# Altium schematic sheet 1_P1.schdoc.schdoc
size 309 x 223 mm; Symbol: Sheet-Symbol_A4; Device: Sheet-Symbol_A4; Company: 嘉立创EDA; Version: V1.0; Page Size: A4; @Project Name: Soft_Pico_ESP; @Page Count: 1; @Update Date: 2024-06-13; @Create Date: 2024-06-13; @Schematic Name: Schematic2; @Page No: 1; @Page Name: P1
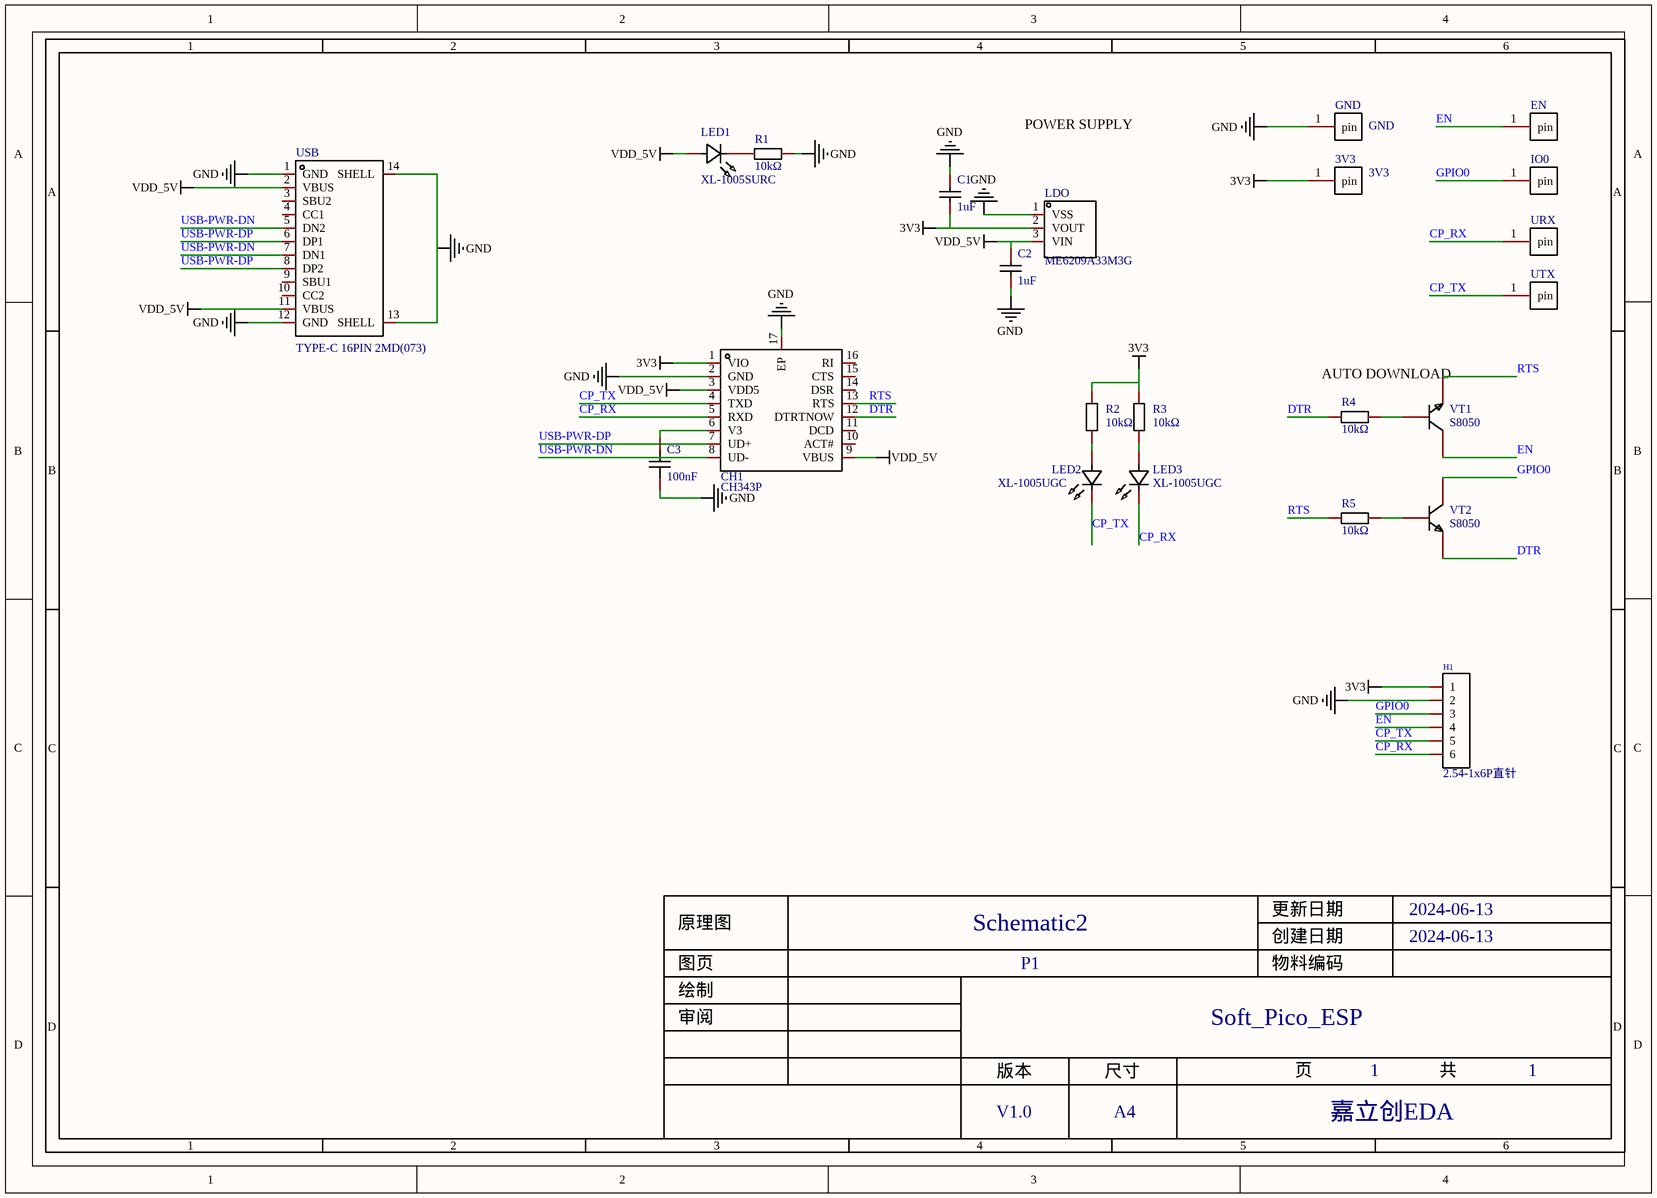
[diagram p0: 1_P1.schdoc.schdoc]

## Parts
3V3  3V3  [FPCB焊脚]
C1  1uF  [c0402]
C2  1uF  [c0402]
C3  100nF  [c0402]
CH1  CH343P  [TQFN-16_L3.0-W3.0-P0.50-BL-EP1.7]
EN  FPCB焊脚  [FPCB焊脚]  (value not drawn)
GND  GND  [FPCB焊脚]
H1  2.54-1x6P直针  [HDR-TH_6P-P2.54-V-M-1]
IO0  FPCB焊脚  [FPCB焊脚]  (value not drawn)
LDO  ME6209A33M3G  [SOT-23-3_L2.9-W1.6-P1.90-LS2.8-BR]
LED1  XL-1005SURC  [LED0402-R-RD_RED]
LED2  XL-1005UGC  [LED0402-RD_GREEN]
LED3  XL-1005UGC  [LED0402-RD_GREEN]
R1  value 10kΩ  [R0402]  (hidden comment: TR0402D10K0Q1025Z)
R2  value 10kΩ  [R0402]  (hidden comment: TR0402D10K0Q1025Z)
R3  value 10kΩ  [R0402]  (hidden comment: TR0402D10K0Q1025Z)
R4  value 10kΩ  [R0402]  (hidden comment: TR0402D10K0Q1025Z)
R5  value 10kΩ  [R0402]  (hidden comment: TR0402D10K0Q1025Z)
URX  FPCB焊脚  [FPCB焊脚]  (value not drawn)
USB  TYPE-C 16PIN 2MD(073)  [USB-C-SMD_TYPE-C-6PIN-2MD-073]
UTX  FPCB焊脚  [FPCB焊脚]  (value not drawn)
VT1  S8050  [SMT_TRIODE_NPN]
VT2  S8050  [SMT_TRIODE_NPN]

## Nets
3V3: 3V3.1(pin) C1.1 CH1.1(VIO) H1.1 LDO.2(VOUT) R2.1 R3.1
GND: C1.2 C2.1 C3.1 CH1.2(GND) CH1.17(EP) GND.1(pin) H1.2 LDO.1(VSS) R1.1 USB.1(GND) USB.12(GND) USB.13(SHELL) USB.14(SHELL)
VDD_5V: C2.2 CH1.3(VDD5) CH1.9(VBUS) LDO.3(VIN) LED1.1(K) USB.2(VBUS) USB.11(VBUS)
CP_RX: CH1.5(RXD) H1.6 LED3.1(K) URX.1(pin)
CP_TX: CH1.4(TXD) H1.5 LED2.1(K) UTX.1(pin)
DTR: CH1.12(DTRTNOW) R4.1 VT2.2(E)
EN: EN.1(pin) H1.4 VT1.3(C)
GPIO0: H1.3 IO0.1(pin) VT2.3(C)
RTS: CH1.13(RTS) R5.1 VT1.2(E)
USB-PWR-DN: CH1.8(UD-) USB.5(DN2) USB.7(DN1)
USB-PWR-DP: CH1.7(UD+) USB.6(DP1) USB.8(DP2)
NetC3_2: C3.2 CH1.6(V3)
NetLED1_2: LED1.2(A) R1.2
NetLED2_2: LED2.2(A) R2.2
NetLED3_2: LED3.2(A) R3.2
NetR4_2: R4.2 VT1.1(B)
NetR5_2: R5.2 VT2.1(B)

Not connected (* = marked no-connect by the designer): CH1 10(ACT#) 11(DCD) 14(DSR) 15(CTS) 16(RI); USB 3(SBU2) 4(CC1) 9(SBU1) 10(CC2)

## Notes on the sheet
- POWER SUPPLY
- AUTO DOWNLOAD
- 1
- 2
- 3
- 4
- 5
- 6
- A
- B
- C
- 原理图
- Schematic2
- 创建日期
- 更新日期
- 2024-06-13
- 审阅
- 绘制
- 图页
- P1
- 物料编码
- Soft_Pico_ESP
- D
- 版本
- 尺寸
- 页
- 共
- V1.0
- A4
- 嘉立创EDA

## Library data of the parts
3V3 EN GND IO0 URX UTX = FPCB焊脚: Add into BOM: yes; Symbol: FPCB焊脚; Device: FPCB焊脚; Convert to PCB: yes
  3V3: Name: 3V3
  GND: Name: GND
C1 C2 = CL05A105KP5NNNC: Manufacturer: SAMSUNG(三星); Add into BOM: yes; Tolerance: ±10%; Voltage Rated: 10V; Temperature Coefficient: X5R; Description: 容值:1uF;精度:±10%;额定电压:10V;材质(温度系数):X5R;; Name: 1uF; Symbol: CL05A105KP5NNNC; Device: CL05A105KP5NNNC; LCSC Part Name: 1uF ±10% 10V; Supplier Part: C14445; Manufacturer Part: CL05A105KP5NNNC; Supplier Footprint: 0402; JLCPCB Part Class: 扩展库; Datasheet: https://atta.szlcsc.com/upload/public/pdf/source/20160103/1457707670698.pdf; Supplier: LCSC; Convert to PCB: yes; Value: 1uF
C3 = CC0402KRX7R7BB104: Manufacturer: YAGEO(国巨); Add into BOM: yes; Tolerance: ±10%; Voltage Rated: 16V; Temperature Coefficient: X7R; Description: 容值:100nF;精度:±10%;额定电压:16V;材质(温度系数):X7R;; Name: 100nF; Symbol: CC0402KRX7R7BB104; Device: CC0402KRX7R7BB104; LCSC Part Name: 100nF ±10% 16V; Supplier Part: C60474; Manufacturer Part: CC0402KRX7R7BB104; Supplier Footprint: 0402; JLCPCB Part Class: 扩展库; Datasheet: https://atta.szlcsc.com/upload/public/pdf/source/20211223/9278FD768280B81DDBEF48FA36411A03.pdf; Supplier: LCSC; Convert to PCB: yes; Value: 100nF
CH1 = CH343P: Manufacturer: WCH(南京沁恒); Add into BOM: yes; Description: 应用功能:-;接口协议:-;; Name: CH343P; Symbol: CH343P; Device: CH343P; LCSC Part Name: CH343P; Supplier Part: C2846043; Manufacturer Part: CH343P; Supplier Footprint: TQFN-16-EP(3x3); JLCPCB Part Class: 扩展库; Datasheet: https://atta.szlcsc.com/upload/public/pdf/source/20211010/C2846043_7FA705E1F14A2906F6A2AFA45FA28209.pdf; Supplier: LCSC; Convert to PCB: yes; Applications Function: -; Protocol: -
H1 = 2.54-1x6P直针: Manufacturer: BOOMELE(博穆精密); Symbol: Header-Male-2.54_1x6; Add into BOM: yes; Pin Structure: 1x6P; Pitch: 2.54mm; Circluar Pins/Square Pins: 方针; Current Rating (Max): 3A; Description: 插针结构:1x6P;间距:2.54mm;行距:-;圆针/方针:方针;安装类型:直插;排数:单排;总PIN位数:6P;额定电流:3A;额定电压:-;配合针长度:-;塑高:-;触头材质:黄铜;触头镀层:-;工作温度范围:-40℃~+105℃;颜色:黑色;; Name: 2.54-1x6P直针; Device: 2.54-1x6P直针; Supplier: LCSC; Manufacturer Part: 2.54-1x6P直针; Supplier Part: C37208; JLCPCB Part Class: 扩展库; LCSC Part Name: 间距:2.54mm 1x6P 直插 方针; Supplier Footprint: 插件,P=2.54mm; Convert to PCB: yes; Row Spacing: -; Mounting Type: 直插; Number of Rows: 单排; Number of Pins: 6P; Voltage Rating (Max): -; Length of Mating Pin: -; Insulation Height: -; Contact Material: 黄铜; Contact Plating: -; Operating Temperature Range: -40℃~+105℃; Color: 黑色
LDO = ME6209A33M3G: Manufacturer: MICRONE(南京微盟); Add into BOM: yes; Output Type: 固定; Maximum Input Voltage: 18V; Output Voltage: 3.3V; MAX Output Current: 250mA; Dropout Voltage: 80mV@(40mA); Output Polarity: 正极; Number of Outputs: 1; Description: 输出类型:固定;最大输入电压:18V;输出电压:3.3V;最大输出电流:250mA;电源纹波抑制比(PSRR):-;输出极性:正极;; Name: ME6209A33M3G; Symbol: ME6209A33M3G; Device: ME6209A33M3G; Supplier: LCSC; Manufacturer Part: ME6209A33M3G; Supplier Part: C83508; JLCPCB Part Class: 扩展库; LCSC Part Name: 输入18V 输出3.3V 250mA; Supplier Footprint: SOT-23-3L; Datasheet: https://atta.szlcsc.com/upload/public/pdf/source/20161212/1481539101152.pdf; Convert to PCB: yes; Power Supply Rejection Ratio (PSRR): -
LED1 = XL-1005SURC: Manufacturer: XINGLIGHT(成兴光); Add into BOM: yes; Emitted Color: 红色; Power Dissipation: 55mW; Forward Current: 25mA; Dominant Wavelength: 620nm; Peak Wavelength: 625nm; Lens Color: 无色透明透镜; Color Temperature: 6000K~7000K; Viewing Angle: 120°; Mounting Sytle: 正贴; Description: 发光颜色:红色;功率:55mW;正向电流:25mA;主波长:620nm;透镜颜色:无色透明透镜;色温:6000K~7000K;发光角度:120°;载带方式:正贴;工作温度:-30℃~+85℃;; Name: XL-1005SURC; Symbol: XL-1005SURC; Device: XL-1005SURC; Supplier: LCSC; Supplier Part: C965790; Manufacturer Part: XL-1005SURC; JLCPCB Part Class: 扩展库; LCSC Part Name: XL-1005SURC; Supplier Footprint: 0402; Datasheet: https://atta.szlcsc.com/upload/public/pdf/source/20221102/EBA3AB29C2D5B62EE70B36967F8F8809.pdf; Convert to PCB: yes; Operating Temperature: -30℃~+85℃
LED2 LED3 = XL-1005UGC: Manufacturer: XINGLIGHT(成兴光); Symbol: XL-1005UGC_C2856703; Add into BOM: yes; Emitted Color: 翠绿色; Power Dissipation: 80mW; Forward Current: 25mA; Dominant Wavelength: 516nm; Peak Wavelength: 531nm; Lens Color: 无色透明透镜; Viewing Angle: 120°; Mounting Sytle: 正贴; Description: 发光颜色:翠绿色;功率:80mW;正向电流:25mA;主波长:516nm;透镜颜色:无色透明透镜;色温:-;发光角度:120°;载带方式:正贴;工作温度:-30℃~+85℃;; Name: XL-1005UGC; Device: XL-1005UGC; LCSC Part Name: XL-1005UGC; Supplier Part: C2856703; Manufacturer Part: XL-1005UGC; Supplier Footprint: 0402; JLCPCB Part Class: 扩展库; Datasheet: https://atta.szlcsc.com/upload/public/pdf/source/20221102/FF8D6BC2225363A60A01D46BB802F217.pdf; Supplier: LCSC; Convert to PCB: yes; Color Temperature: -; Operating Temperature: -30℃~+85℃
R1-R5 = TR0402D10K0Q1025Z: 电阻类型:薄膜电阻;阻值:10kΩ;精度:±0.5%;功率:63mW;温度系数:±25ppm/;最大工作电压:25V;工作温度范围:-55~+155;; Manufacturer: EVER OHMS(天二科技); Symbol: TR0402D10KQ1025; Add into BOM: yes; Tolerance: ±0.5%; Power(Watts): 63mW; Temperature Coefficient: ±25ppm/; Overload Voltage (Max): 25V; Device: TR0402D10K0Q1025Z; LCSC Part Name: 10kΩ ±0.5%; Supplier Part: C149898; Manufacturer Part: TR0402D10K0Q1025Z; Supplier Footprint: 0402; JLCPCB Part Class: Extended Part; Datasheet: https://atta.szlcsc.com/upload/public/pdf/source/20190415/C149898_7B08651CD36798FFD08F99A8D38CFCAF.pdf; Supplier: LCSC; Convert to PCB: yes; Type: 薄膜电阻; Operating Temperature Range: -55~+155
USB = TYPE-C 16PIN 2MD(073): Manufacturer: SHOU HAN(首韩); Add into BOM: yes; Gender: 母; Number of Ports: 1; Number of Contacts: 16P; Current Rating - Power (Max): 5A; Description: 连接器类型:Type-C;标准:-;公母:母;端口数量:1;触点数量:16P;安装方式:卧贴;额定电流 - 电源:5A;工作温度范围:-25℃~+85℃;; Name: TYPE-C 16PIN 2MD(073); Symbol: TYPE-C 16PIN 2MD(073); Device: TYPE-C 16PIN 2MD(073); Supplier: LCSC; Supplier Part: C2765186; Manufacturer Part: TYPE-C 16PIN 2MD(073); JLCPCB Part Class: 扩展库; LCSC Part Name: Type-C 母 卧贴; Supplier Footprint: SMD; Datasheet: https://atta.szlcsc.com/upload/public/pdf/source/20211123/39B17C16241EAC15C5E277BDA434118E.pdf; Convert to PCB: yes; Connector Type: Type-C; Standard: -; Mounting Style: 卧贴; Operating Temperature Range: -25℃~+85℃
VT1 VT2 = S8050: Surface mount NPN transistor, package SOT-23; Add into BOM: yes; Name: S8050; Symbol: SMT_TRIODE_NPN; Device: S8050; Convert to PCB: yes; Origin Footprint: SMT_TRIODE_NPN; Design Item ID: SMT_TRIODE_NPN; Library Name: MyPcbLib